# Altium project Sayma_RTM.PrjPcb (part 11 of 11)
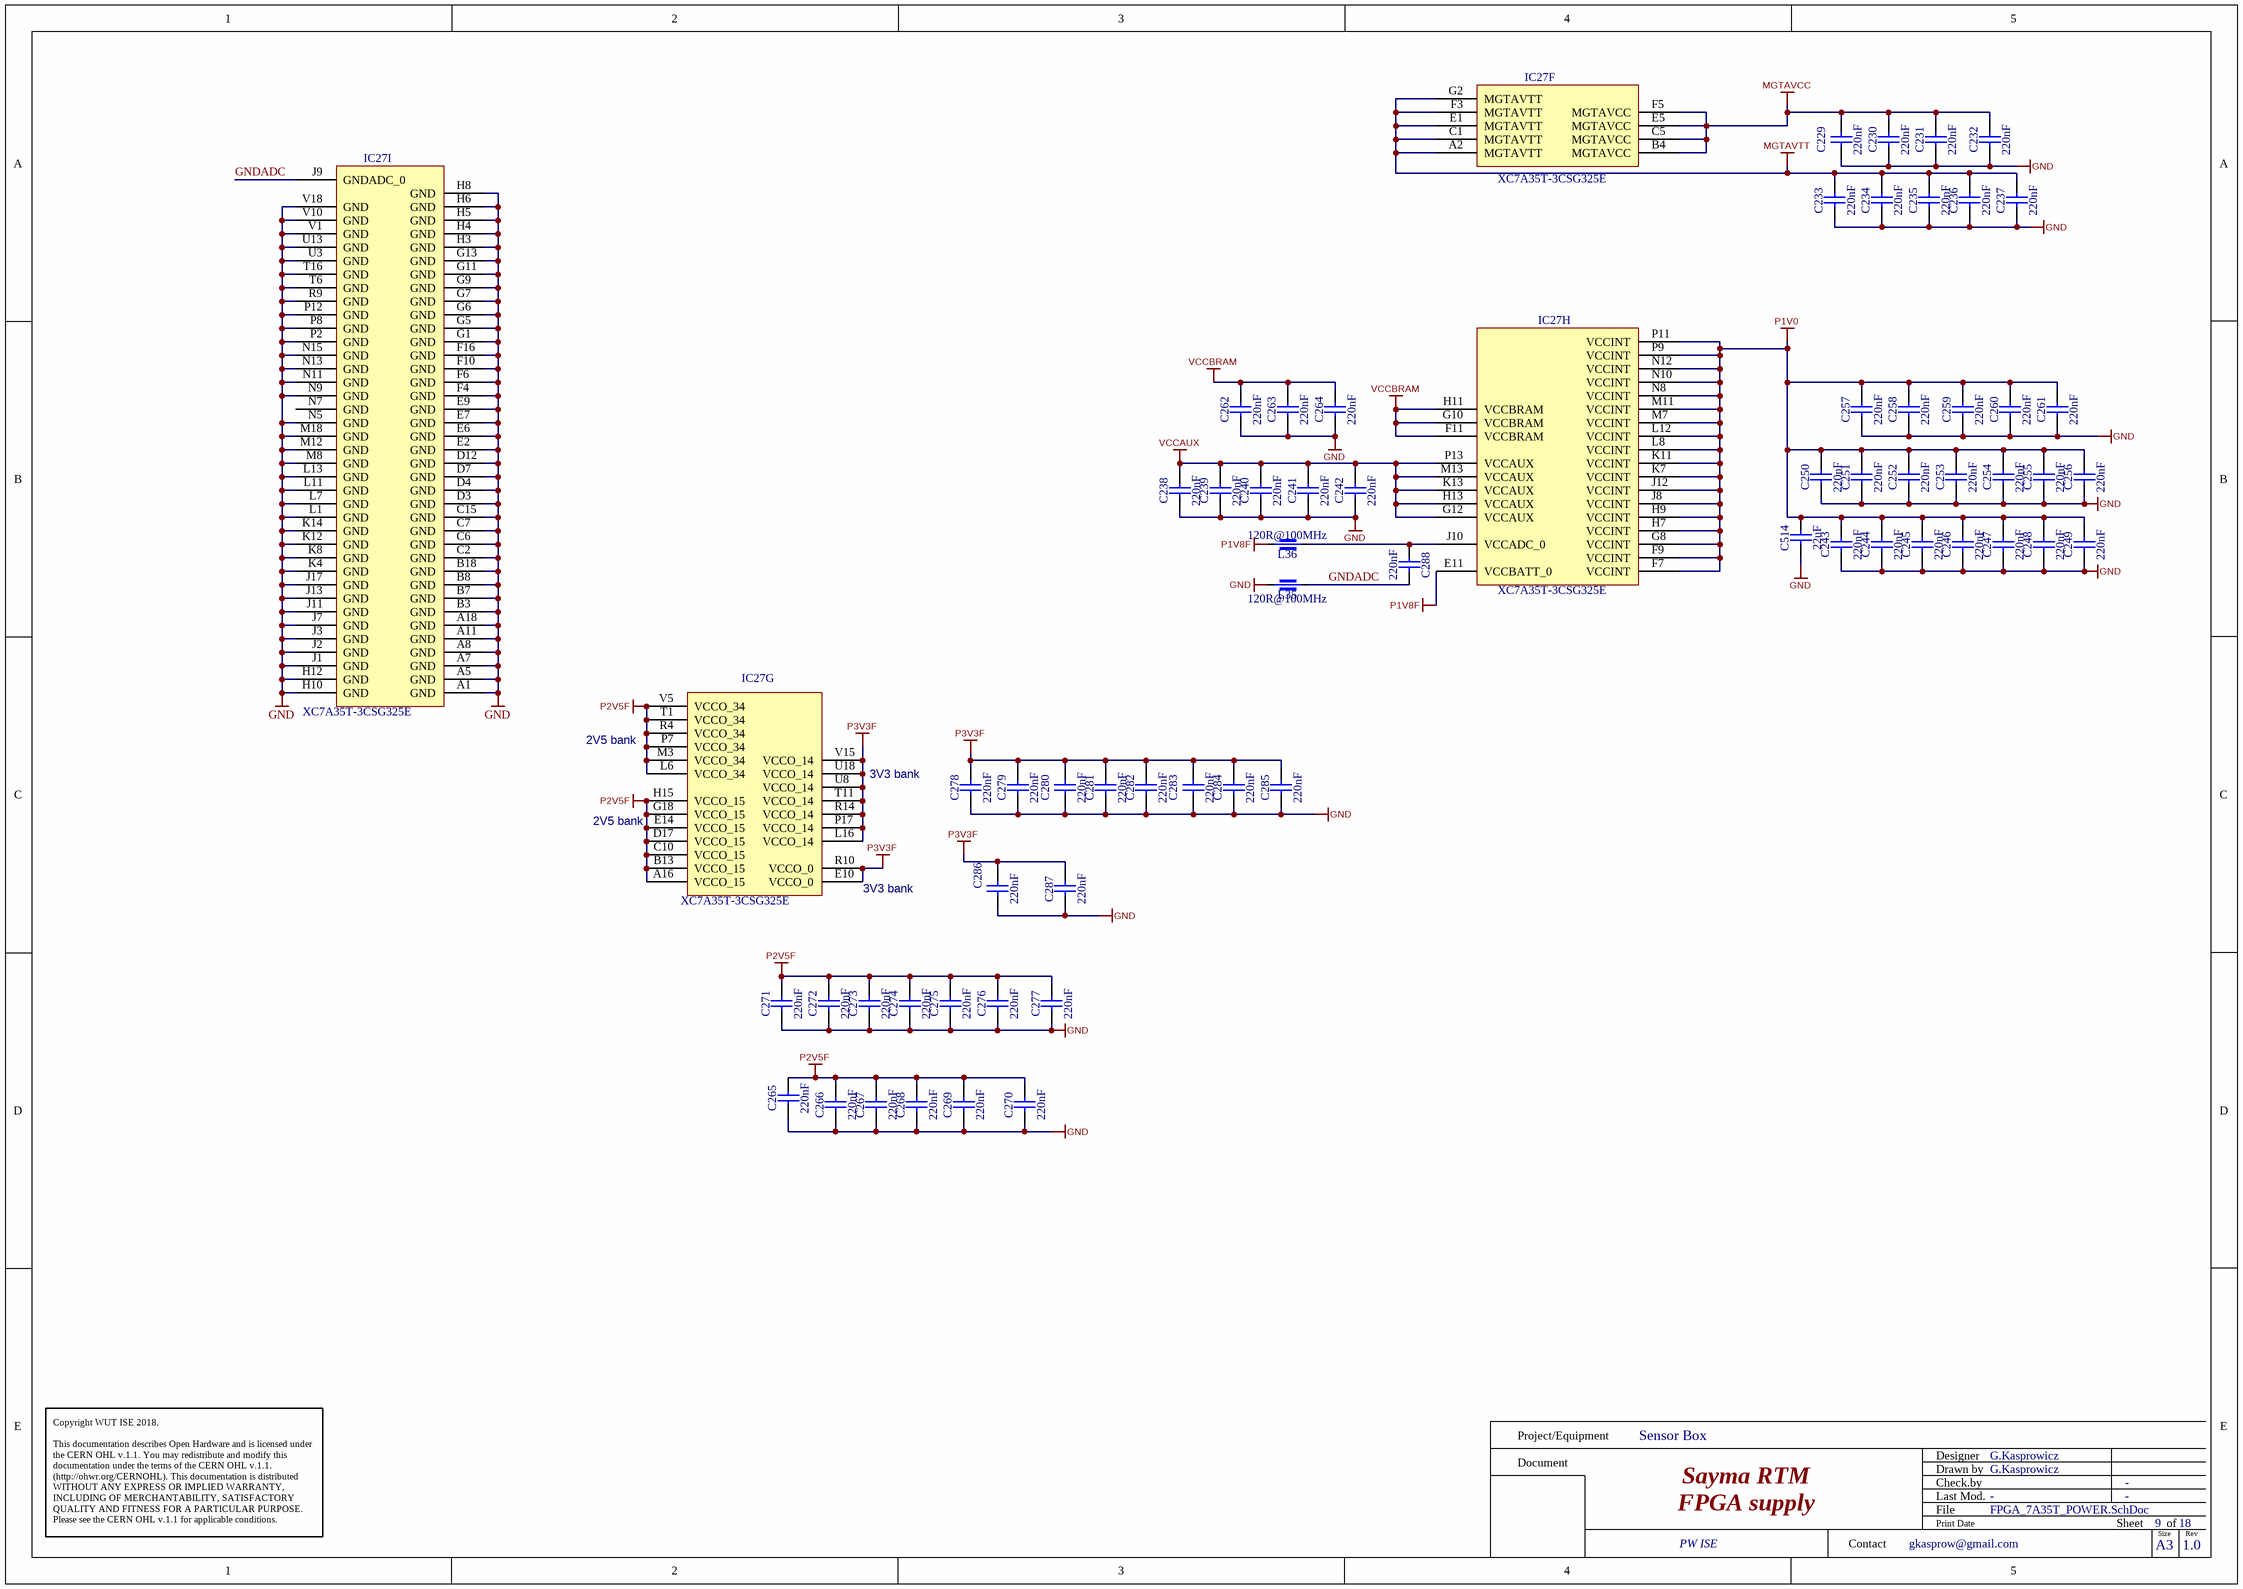
[diagram p117: FPGA_7A35T_POWER.SchDoc]

## Nets that join several sheets
GND: Sayma_RTM (9 pins), FPGA_7A35T (27 pins), DAC_JESD204B1 (158 pins), DAC_JESD204B0 (158 pins), PWR_SEPIC_N6V (60 pins), PWR_SEPIC_P12V_N12V (71 pins), PWR_Buck_2V_4V_4A (89 pins), PWR_Buck_6V_8A (25 pins), PWR_buck_FPGA_EXAR (74 pins), SI5324_CDR_WR_clocks (60 pins), HMC830_CLK_DIST (105 pins), RTM_IPMI (26 pins), DAC_AFE_Mezzanine0 (312 pins), I2C_Switch_temp_sens (16 pins), RTM_CON (62 pins), DAC_AFE_Mezzanine1 (312 pins), CLK_HMC7043 (73 pins), FPGA_7A35T_GTP (7 pins), FPGA_7A35T_POWER (135 pins)
MGTAVCC: PWR_buck_FPGA_EXAR (C548.2 L27.2), FPGA_7A35T_POWER (8 pins)
MGTAVTT: PWR_buck_FPGA_EXAR (C106.2 C551.2 L58.2 NT9.2), FPGA_7A35T_GTP (R35.1), FPGA_7A35T_POWER (10 pins)
N6V0A: PWR_SEPIC_N6V (5 pins), DAC_AFE_Mezzanine0 (L5A.2), DAC_AFE_Mezzanine1 (L5B.2)
N12V0A: PWR_SEPIC_P12V_N12V (5 pins), DAC_AFE_Mezzanine0 (L3A.2), DAC_AFE_Mezzanine1 (L3B.2)
P1V0: PWR_buck_FPGA_EXAR (5 pins), FPGA_7A35T_POWER (38 pins)
P1V8F: PWR_buck_FPGA_EXAR (10 pins), FPGA_7A35T_POWER (IC27.E11 L36.1)
P2V0: DAC_JESD204B1 (30 pins), DAC_JESD204B0 (30 pins), PWR_Buck_2V_4V_4A (C501.1 C580.2 L7.2), PWR_buck_FPGA_EXAR (NT3.1)
P2V5F: FPGA_7A35T (12 pins), DAC_JESD204B1 (L14A.1), DAC_JESD204B0 (L14B.1), PWR_buck_FPGA_EXAR (10 pins), DAC_AFE_Mezzanine0 (L6A.2), DAC_AFE_Mezzanine1 (L6B.2), FPGA_7A35T_GTP (L34.2), FPGA_7A35T_POWER (26 pins)
P3V3: PWR_buck_FPGA_EXAR (C506.1 C588.2 L11.2 NT2.2), DAC_AFE_Mezzanine0 (L4A.2), I2C_Switch_temp_sens (12 pins), DAC_AFE_Mezzanine1 (L4B.2)
P3V3_CLKDIS1: HMC830_CLK_DIST (L24.1), CLK_HMC7043 (7 pins)
P3V3F: FPGA_7A35T (14 pins), PWR_buck_FPGA_EXAR (C547.2 L11.1 L59.2 L60.2), FPGA_7A35T_POWER (19 pins)
P3V3MP: RTM_POWER_SUPPLY (R90.2), PWR_buck_FPGA_EXAR (5 pins), RTM_IPMI (34 pins), DAC_AFE_Mezzanine0 (L9A.2), I2C_Switch_temp_sens (24 pins), RTM_CON (J1.c2), DAC_AFE_Mezzanine1 (L9B.2)
P4V0: DAC_JESD204B1 (5 pins), DAC_JESD204B0 (5 pins), PWR_Buck_2V_4V_4A (C500.1 C579.2 L40.2 NT1.1), SI5324_CDR_WR_clocks (L17.1), CLK_HMC7043 (L89.1)
P6V0A: PWR_Buck_6V_8A (C502.1 C581.2 L8.2 NT5.1), HMC830_CLK_DIST (L13.1 R127.2), DAC_AFE_Mezzanine0 (L2A.1), DAC_AFE_Mezzanine1 (L2B.1)
P12V0: PWR_SEPIC_N6V (10 pins), PWR_SEPIC_P12V_N12V (10 pins), PWR_Buck_2V_4V_4A (40 pins), PWR_Buck_6V_8A (6 pins), PWR_buck_FPGA_EXAR (15 pins), RTM_CON (J1.a1 J1.a2 J1.b1 J1.b2)
P12V0A: PWR_SEPIC_P12V_N12V (5 pins), DAC_AFE_Mezzanine0 (L1A.1), DAC_AFE_Mezzanine1 (L1B.1)
VCCAUX: PWR_buck_FPGA_EXAR (C510.2 L19.2), FPGA_7A35T_POWER (10 pins)
VCCBRAM: PWR_buck_FPGA_EXAR (C103.2 L28.2), FPGA_7A35T_POWER (6 pins)
CDR_CLK_CLEAN2_N: FPGA_7A35T (IC27.R1 R245.2), SI5324_CDR_WR_clocks (C129.2)
CDR_CLK_CLEAN2_P: FPGA_7A35T (IC27.R2 R244.2), SI5324_CDR_WR_clocks (C128.2)
CDR_CLK_CLEAN3_N: SI5324_CDR_WR_clocks (C122.2), HMC830_CLK_DIST (IC46.2)
CDR_CLK_CLEAN3_P: SI5324_CDR_WR_clocks (C121.2), HMC830_CLK_DIST (IC46.1)
CDR_CLK_CTRL.CDR_CLK_CLEAN1_N: SI5324_CDR_WR_clocks (C359.2), FPGA_7A35T_GTP (IC27.B5)
CDR_CLK_CTRL.CDR_CLK_CLEAN1_P: SI5324_CDR_WR_clocks (C125.2), FPGA_7A35T_GTP (IC27.B6)
DAC0_IRQn: FPGA_7A35T (IC27.T4), DAC_JESD204B0 (IC5B.60)
DAC0_RESETn: FPGA_7A35T (IC27.T3), DAC_JESD204B0 (IC5B.61)
DAC0_SPI_CSn: FPGA_7A35T (IC27.U4), DAC_JESD204B0 (IC5B.65 TP66B.1)
DAC0_SPI_SCLK: FPGA_7A35T (IC27.V4), DAC_JESD204B0 (IC5B.64 TP65B.1)
DAC0_SPI_SDIO: FPGA_7A35T (IC27.P6), DAC_JESD204B0 (IC5B.63 TP64B.1)
DAC0_SPI_SDO: FPGA_7A35T (IC27.P5), DAC_JESD204B0 (IC5B.62 TP63B.1)
DAC0_TXEN0: FPGA_7A35T (IC27.U6), DAC_JESD204B0 (IC5B.11)
DAC0_TXEN1: FPGA_7A35T (IC27.U5), DAC_JESD204B0 (IC5B.12)
DAC1_IRQn: FPGA_7A35T (IC27.K5), DAC_JESD204B1 (IC5A.60)
DAC1_RESETn: FPGA_7A35T (IC27.J5), DAC_JESD204B1 (IC5A.61)
DAC1_SPI_CSn: FPGA_7A35T (IC27.J4), DAC_JESD204B1 (IC5A.65 TP66A.1)
DAC1_SPI_SCLK: FPGA_7A35T (IC27.K2), DAC_JESD204B1 (IC5A.64 TP65A.1)
DAC1_SPI_SDIO: FPGA_7A35T (IC27.K1), DAC_JESD204B1 (IC5A.63 TP64A.1)
DAC1_SPI_SDO: FPGA_7A35T (IC27.K3), DAC_JESD204B1 (IC5A.62 TP63A.1)
DAC1_TXEN0: FPGA_7A35T (IC27.L2), DAC_JESD204B1 (IC5A.11)
DAC1_TXEN1: FPGA_7A35T (IC27.L4), DAC_JESD204B1 (IC5A.12)
DAC_CLK_N: DAC_JESD204B1 (IC5A.3 R232A.1), CLK_HMC7043 (C354.2)
DAC_CLK_N: DAC_JESD204B0 (IC5B.3 R232B.1), CLK_HMC7043 (C358.2)
DAC_CLK_P: DAC_JESD204B1 (IC5A.2 R232A.2), CLK_HMC7043 (C353.2)
DAC_CLK_P: DAC_JESD204B0 (IC5B.2 R232B.2), CLK_HMC7043 (C357.2)
DAC_SYSREF_N: DAC_JESD204B1 (IC5A.6 R231A.1), CLK_HMC7043 (R56.2 R130.1)
DAC_SYSREF_N: DAC_JESD204B0 (IC5B.6 R231B.1), CLK_HMC7043 (R58.2 R132.1)
DAC_SYSREF_P: DAC_JESD204B1 (IC5A.5 R231A.2), CLK_HMC7043 (R39.2 R126.1)
DAC_SYSREF_P: DAC_JESD204B0 (IC5B.5 R231B.2), CLK_HMC7043 (R57.2 R131.1)
EN: PWR_SEPIC_N6V (IC50.B7 IC50.K7), PWR_SEPIC_P12V_N12V (IC49.B7 IC49.K7), PWR_Buck_2V_4V_4A (IC18.J5 IC18.J9), PWR_Buck_6V_8A (IC48.10), PWR_buck_FPGA_EXAR (IC33.C6 MOD1.12 R182.1), RTM_IPMI (D1.2 R121.1 T2.3)
EN_PWR_HMC830: FPGA_7A35T (IC6.9), HMC830_CLK_DIST (5 pins)
EXAR_I2C.SCL: PWR_buck_FPGA_EXAR (MOD1.11 W1.2), I2C_Switch_temp_sens (IC1.17 IC2.17 R1.1 TP25.1)
EXAR_I2C.SDA: PWR_buck_FPGA_EXAR (MOD1.10 W1.3), I2C_Switch_temp_sens (IC1.16 IC2.16 R2.1 TP24.1)
FPGA_DXN: FPGA_7A35T (IC27.M9), RTM_IPMI (C107.1 C156.1 R99.1)
FPGA_DXP: FPGA_7A35T (IC27.M10), RTM_IPMI (C107.2 C156.2 IC35.3)
GT16RX_N: RTM_CON (J1.b10), FPGA_7A35T_GTP (C159.1)
GT16RX_P: RTM_CON (J1.a10), FPGA_7A35T_GTP (C160.1)
GT16TX_N: RTM_CON (J1.b8), FPGA_7A35T_GTP (IC27.E3)
GT16TX_P: RTM_CON (J1.a8), FPGA_7A35T_GTP (IC27.E4)
GT_CLK0_IN_N: RTM_CON (J2.b1), CLK_HMC7043 (R93.2)
GT_CLK0_IN_P: RTM_CON (J2.a1), CLK_HMC7043 (R33.2)
Helper_DCXO_N: FPGA_7A35T (IC27.N2 R125.2), SI5324_CDR_WR_clocks (R297.2)
Helper_DCXO_OE: FPGA_7A35T (IC14.9), SI5324_CDR_WR_clocks (R383.2 R385.2)
Helper_DCXO_P: FPGA_7A35T (IC27.N3 R60.2), SI5324_CDR_WR_clocks (R296.2)
Helper_DCXO_SCL: FPGA_7A35T (IC27.T15), SI5324_CDR_WR_clocks (OSC5.8 R365.1 TP32.1)
Helper_DCXO_SDA: FPGA_7A35T (IC27.R16), SI5324_CDR_WR_clocks (OSC5.7 R364.1 TP31.1)
HMC830_SPI_SEN: FPGA_7A35T (IC27.K16), HMC830_CLK_DIST (IC40.30 R107.2 TP5.1)
HMC7043_RESET: FPGA_7A35T (IC27.J18 R52.2), CLK_HMC7043 (IC58.5)
HMC7043_SLEN: FPGA_7A35T (IC27.R17), CLK_HMC7043 (IC58.31 TP58.1)
HMC_7043_OUT_EN: FPGA_7A35T (IC6.8), CLK_HMC7043 (R94.2 T11.1 TP62.1)
HMC_SPI_GPIO: FPGA_7A35T (IC27.L14), CLK_HMC7043 (IC58.34 TP61.1)
HMC_SPI_SCLK: FPGA_7A35T (IC27.T18), HMC830_CLK_DIST (IC40.32 R108.2 TP2.1), CLK_HMC7043 (IC58.32 TP59.1)
HMC_SPI_SDATA: FPGA_7A35T (IC27.R18), HMC830_CLK_DIST (IC40.31 TP3.1), CLK_HMC7043 (IC58.33 TP60.1)
HMC_SPI_SDO: FPGA_7A35T (IC27.J15), HMC830_CLK_DIST (IC40.33 TP4.1)
I2C_SCL0: DAC_AFE_Mezzanine0 (J11A.k35), I2C_Switch_temp_sens (IC1.2 IC2.2 R15.1 TP10.1)
I2C_SCL0: I2C_Switch_temp_sens (IC1.6 IC2.6 R11.1 TP15.1), DAC_AFE_Mezzanine1 (J11B.k35)
I2C_SCL1: DAC_AFE_Mezzanine0 (J11A.j35), I2C_Switch_temp_sens (IC1.4 IC2.4 R13.1 TP13.1)
I2C_SCL1: I2C_Switch_temp_sens (IC1.8 IC2.8 R9.1 TP17.1), DAC_AFE_Mezzanine1 (J11B.j35)
I2C_SDA0: DAC_AFE_Mezzanine0 (J11A.k34), I2C_Switch_temp_sens (IC1.1 IC2.1 R16.1 TP8.1)
I2C_SDA0: I2C_Switch_temp_sens (IC1.5 IC2.5 R12.1 TP14.1), DAC_AFE_Mezzanine1 (J11B.k34)
I2C_SDA1: DAC_AFE_Mezzanine0 (J11A.j34), I2C_Switch_temp_sens (IC1.3 IC2.3 R14.1 TP12.1)
I2C_SDA1: I2C_Switch_temp_sens (IC1.7 IC2.7 R10.1 TP16.1), DAC_AFE_Mezzanine1 (J11B.j34)
I2C_SW_FPGA_RESETn: FPGA_7A35T (IC27.R15), I2C_Switch_temp_sens (IC2.24 R27.1)
IPMI_I2C.SCL: RTM_IPMI (7 pins), I2C_Switch_temp_sens (IC1.19 R20.2 TP7.1)
IPMI_I2C.SDA: RTM_IPMI (7 pins), I2C_Switch_temp_sens (IC1.20 R21.2 TP6.1)
JTAG.TCK: FPGA_7A35T (IC27.F8), RTM_CON (J1.e1)
JTAG.TDI: FPGA_7A35T (IC27.T9), RTM_CON (J1.e2)
JTAG.TDO: FPGA_7A35T (IC27.T8), RTM_CON (J1.f1)
JTAG.TMS: FPGA_7A35T (IC27.R8), RTM_CON (J1.f2)
Main_DCXO_OE: FPGA_7A35T (IC14.10), SI5324_CDR_WR_clocks (R382.2 R384.2)
Main_DCXO_SCL: FPGA_7A35T (IC27.P14), SI5324_CDR_WR_clocks (OSC4.8 R362.1 TP28.1)
Main_DCXO_SDA: FPGA_7A35T (IC27.U15), SI5324_CDR_WR_clocks (OSC4.7 R361.1 TP27.1)
MEZZ0_IO0: FPGA_7A35T (IC27.U16), DAC_AFE_Mezzanine0 (J11A.f37)
MEZZ0_IO1: FPGA_7A35T (IC27.V16), DAC_AFE_Mezzanine0 (J11A.g37)
MEZZ0_IO2: FPGA_7A35T (IC27.V17), DAC_AFE_Mezzanine0 (J11A.h37)
MEZZ0_IO3: FPGA_7A35T (IC27.R13), DAC_AFE_Mezzanine0 (J11A.j39)
MEZZ0_IO4: FPGA_7A35T (IC27.T13), DAC_AFE_Mezzanine0 (J11A.j38)
MEZZ0_IO5: FPGA_7A35T (IC27.U14), DAC_AFE_Mezzanine0 (J11A.j37)
MEZZ0_IO6: FPGA_7A35T (IC27.V14), DAC_AFE_Mezzanine0 (J11A.k39)
MEZZ0_IO7: FPGA_7A35T (IC27.V12), DAC_AFE_Mezzanine0 (J11A.k38)
MEZZ0_IO8: FPGA_7A35T (IC27.V13), DAC_AFE_Mezzanine0 (J11A.k37)
MEZZ0_IO9: FPGA_7A35T (IC27.T12), DAC_AFE_Mezzanine0 (J11A.e37)
MEZZ0_IO10: FPGA_7A35T (IC27.U12), DAC_AFE_Mezzanine0 (J11A.d37)
MEZZ0_IO11: FPGA_7A35T (IC27.U11), DAC_AFE_Mezzanine0 (J11A.c37)
MEZZ0_IO12: FPGA_7A35T (IC27.V11), DAC_AFE_Mezzanine0 (J11A.b37)
MEZZ0_IO13: FPGA_7A35T (IC27.U9), DAC_AFE_Mezzanine0 (J11A.b36)
MEZZ0_IO14: FPGA_7A35T (IC27.V9), DAC_AFE_Mezzanine0 (J11A.a37)
MEZZ0_IO15: FPGA_7A35T (IC27.U10), DAC_AFE_Mezzanine0 (J11A.a36)
MEZZ0_LVDS0_N: FPGA_7A35T (IC27.E18), DAC_AFE_Mezzanine0 (J11A.a39)
MEZZ0_LVDS0_P: FPGA_7A35T (IC27.F17), DAC_AFE_Mezzanine0 (J11A.a38)
MEZZ0_LVDS1_N: FPGA_7A35T (IC27.F18), DAC_AFE_Mezzanine0 (J11A.b39)
MEZZ0_LVDS1_P: FPGA_7A35T (IC27.G17), DAC_AFE_Mezzanine0 (J11A.b38)
MEZZ0_LVDS2_N: FPGA_7A35T (IC27.H18), DAC_AFE_Mezzanine0 (J11A.c39)
MEZZ0_LVDS2_P: FPGA_7A35T (IC27.H17), DAC_AFE_Mezzanine0 (J11A.c38)
MEZZ0_LVDS3_N: FPGA_7A35T (IC27.F15), DAC_AFE_Mezzanine0 (J11A.d39)
MEZZ0_LVDS3_P: FPGA_7A35T (IC27.G15), DAC_AFE_Mezzanine0 (J11A.d38)
MEZZ0_LVDS4_N: FPGA_7A35T (IC27.F14), DAC_AFE_Mezzanine0 (J11A.e39)
MEZZ0_LVDS4_P: FPGA_7A35T (IC27.G14), DAC_AFE_Mezzanine0 (J11A.e38)
MEZZ0_LVDS5_N: FPGA_7A35T (IC27.D18), DAC_AFE_Mezzanine0 (J11A.f39)
MEZZ0_LVDS5_P: FPGA_7A35T (IC27.E17), DAC_AFE_Mezzanine0 (J11A.f38)
MEZZ0_LVDS6_N: FPGA_7A35T (IC27.C18), DAC_AFE_Mezzanine0 (J11A.g39)
MEZZ0_LVDS6_P: FPGA_7A35T (IC27.C17), DAC_AFE_Mezzanine0 (J11A.g38)
MEZZ0_LVDS7_N: FPGA_7A35T (IC27.G16), DAC_AFE_Mezzanine0 (J11A.h39)
MEZZ0_LVDS7_P: FPGA_7A35T (IC27.H16), DAC_AFE_Mezzanine0 (J11A.h38)
MEZZ1_IO0: FPGA_7A35T (IC27.J16), DAC_AFE_Mezzanine1 (J11B.f37)
MEZZ1_IO1: FPGA_7A35T (IC27.K18), DAC_AFE_Mezzanine1 (J11B.g37)
MEZZ1_IO2: FPGA_7A35T (IC27.K17), DAC_AFE_Mezzanine1 (J11B.h37)
MEZZ1_IO3: FPGA_7A35T (IC27.L18), DAC_AFE_Mezzanine1 (J11B.j39)
MEZZ1_IO4: FPGA_7A35T (IC27.J14), DAC_AFE_Mezzanine1 (J11B.j38)
MEZZ1_IO5: FPGA_7A35T (IC27.K15), DAC_AFE_Mezzanine1 (J11B.j37)
MEZZ1_IO6: FPGA_7A35T (IC27.L15), DAC_AFE_Mezzanine1 (J11B.k39)
MEZZ1_IO7: FPGA_7A35T (IC27.M15), DAC_AFE_Mezzanine1 (J11B.k38)
MEZZ1_IO8: FPGA_7A35T (IC27.M16), DAC_AFE_Mezzanine1 (J11B.k37)
MEZZ1_IO9: FPGA_7A35T (IC27.M17), DAC_AFE_Mezzanine1 (J11B.e37)
MEZZ1_IO10: FPGA_7A35T (IC27.M14), DAC_AFE_Mezzanine1 (J11B.d37)
MEZZ1_IO11: FPGA_7A35T (IC27.N14), DAC_AFE_Mezzanine1 (J11B.c37)
MEZZ1_IO12: FPGA_7A35T (IC27.N16), DAC_AFE_Mezzanine1 (J11B.b37)
MEZZ1_IO13: FPGA_7A35T (IC27.N17), DAC_AFE_Mezzanine1 (J11B.b36)
MEZZ1_IO14: FPGA_7A35T (IC27.N18), DAC_AFE_Mezzanine1 (J11B.a37)
MEZZ1_IO15: FPGA_7A35T (IC27.P18), DAC_AFE_Mezzanine1 (J11B.a36)
MEZZ1_LVDS0_N: FPGA_7A35T (IC27.A14), DAC_AFE_Mezzanine1 (J11B.a39)
MEZZ1_LVDS0_P: FPGA_7A35T (IC27.A13), DAC_AFE_Mezzanine1 (J11B.a38)
MEZZ1_LVDS1_N: FPGA_7A35T (IC27.A12), DAC_AFE_Mezzanine1 (J11B.b39)
MEZZ1_LVDS1_P: FPGA_7A35T (IC27.B12), DAC_AFE_Mezzanine1 (J11B.b38)
MEZZ1_LVDS2_N: FPGA_7A35T (IC27.C12), DAC_AFE_Mezzanine1 (J11B.c39)
MEZZ1_LVDS2_P: FPGA_7A35T (IC27.D11), DAC_AFE_Mezzanine1 (J11B.c38)
MEZZ1_LVDS3_N: FPGA_7A35T (IC27.A10), DAC_AFE_Mezzanine1 (J11B.d39)
MEZZ1_LVDS3_P: FPGA_7A35T (IC27.B10), DAC_AFE_Mezzanine1 (J11B.d38)
MEZZ1_LVDS4_N: FPGA_7A35T (IC27.B11), DAC_AFE_Mezzanine1 (J11B.e39)
MEZZ1_LVDS4_P: FPGA_7A35T (IC27.C11), DAC_AFE_Mezzanine1 (J11B.e38)
MEZZ1_LVDS5_N: FPGA_7A35T (IC27.A9), DAC_AFE_Mezzanine1 (J11B.f39)
MEZZ1_LVDS5_P: FPGA_7A35T (IC27.B9), DAC_AFE_Mezzanine1 (J11B.f38)
MEZZ1_LVDS6_N: FPGA_7A35T (IC27.C9), DAC_AFE_Mezzanine1 (J11B.g39)
MEZZ1_LVDS6_P: FPGA_7A35T (IC27.D9), DAC_AFE_Mezzanine1 (J11B.g38)
MEZZ1_LVDS7_N: FPGA_7A35T (IC27.C8), DAC_AFE_Mezzanine1 (J11B.h39)
MEZZ1_LVDS7_P: FPGA_7A35T (IC27.D8), DAC_AFE_Mezzanine1 (J11B.h38)
OUT0_N: DAC_JESD204B1 (IC5A.83 R223A.1), DAC_AFE_Mezzanine1 (J11B.g23)
OUT0_N: DAC_JESD204B0 (IC5B.83 R223B.1), DAC_AFE_Mezzanine0 (J11A.g23)
OUT0_P: DAC_JESD204B1 (IC5A.84 R224A.1), DAC_AFE_Mezzanine1 (J11B.g24)
OUT0_P: DAC_JESD204B0 (IC5B.84 R224B.1), DAC_AFE_Mezzanine0 (J11A.g24)
OUT1_N: DAC_JESD204B1 (IC5A.79 R225A.1), DAC_AFE_Mezzanine1 (J11B.h17)
OUT1_N: DAC_JESD204B0 (IC5B.79 R225B.1), DAC_AFE_Mezzanine0 (J11A.h17)
OUT1_P: DAC_JESD204B1 (IC5A.78 R226A.1), DAC_AFE_Mezzanine1 (J11B.h18)
OUT1_P: DAC_JESD204B0 (IC5B.78 R226B.1), DAC_AFE_Mezzanine0 (J11A.h18)
OUT2_N: DAC_JESD204B1 (IC5A.73 R227A.1), DAC_AFE_Mezzanine1 (J11B.g11)
OUT2_N: DAC_JESD204B0 (IC5B.73 R227B.1), DAC_AFE_Mezzanine0 (J11A.g11)
OUT2_P: DAC_JESD204B1 (IC5A.74 R228A.1), DAC_AFE_Mezzanine1 (J11B.g12)
OUT2_P: DAC_JESD204B0 (IC5B.74 R228B.1), DAC_AFE_Mezzanine0 (J11A.g12)
OUT3_N: DAC_JESD204B1 (IC5A.69 R229A.1), DAC_AFE_Mezzanine1 (J11B.h5)
OUT3_N: DAC_JESD204B0 (IC5B.69 R229B.1), DAC_AFE_Mezzanine0 (J11A.h5)
OUT3_P: DAC_JESD204B1 (IC5A.68 R230A.1), DAC_AFE_Mezzanine1 (J11B.h6)
OUT3_P: DAC_JESD204B0 (IC5B.68 R230B.1), DAC_AFE_Mezzanine0 (J11A.h6)
PGOOD: RTM_POWER_SUPPLY (R90.1), PWR_SEPIC_N6V (IC50.D6 IC50.H6), PWR_SEPIC_P12V_N12V (IC49.D6 IC49.H6), PWR_Buck_2V_4V_4A (IC18.H5), PWR_Buck_6V_8A (IC48.7), PWR_buck_FPGA_EXAR (MOD1.8), RTM_IPMI (T3.1)
REC_CLOCK_C_N: FPGA_7A35T (IC27.M1), SI5324_CDR_WR_clocks (C173.2 R54.1)
REC_CLOCK_C_P: FPGA_7A35T (IC27.M2), SI5324_CDR_WR_clocks (C172.2 R54.2)
REF0_LO_N: HMC830_CLK_DIST (C224.2), DAC_AFE_Mezzanine0 (J11A.c25)
REF0_LO_P: HMC830_CLK_DIST (C227.2), DAC_AFE_Mezzanine0 (J11A.c26)
REF1_LO_N: HMC830_CLK_DIST (C225.2), DAC_AFE_Mezzanine1 (J11B.c25)
REF1_LO_P: HMC830_CLK_DIST (C226.2), DAC_AFE_Mezzanine1 (J11B.c26)
REF2_N: FPGA_7A35T (IC27.D15 R144.1), HMC830_CLK_DIST (C169.2)
REF2_P: FPGA_7A35T (IC27.E15 R146.1), HMC830_CLK_DIST (C168.2)
REF_CLK_SRC_EXT_SEL: FPGA_7A35T (IC6.10), HMC830_CLK_DIST (IC46.32 TP1.1)
RESETn: FPGA_7A35T (R46.1), RTM_IPMI (IC36.10 R120.1)
RF_OUT_N: HMC830_CLK_DIST (C12.1 C14.1), CLK_HMC7043 (C437.1)
RF_OUT_P: HMC830_CLK_DIST (C11.1 C13.1), CLK_HMC7043 (C436.1)
RTM_FPGA_GTP_Rx1_N: DAC_AFE_Mezzanine0 (J11A.b31), FPGA_7A35T_GTP (IC27.A3)
RTM_FPGA_GTP_Rx1_P: DAC_AFE_Mezzanine0 (J11A.b30), FPGA_7A35T_GTP (IC27.A4)
RTM_FPGA_GTP_Rx3_N: DAC_AFE_Mezzanine1 (J11B.e32), FPGA_7A35T_GTP (IC27.G3)
RTM_FPGA_GTP_Rx3_P: DAC_AFE_Mezzanine1 (J11B.e31), FPGA_7A35T_GTP (IC27.G4)
RTM_FPGA_GTP_Tx1_N: DAC_AFE_Mezzanine0 (J11A.e32), FPGA_7A35T_GTP (C161.1)
RTM_FPGA_GTP_Tx1_P: DAC_AFE_Mezzanine0 (J11A.e31), FPGA_7A35T_GTP (C162.1)
RTM_FPGA_GTP_Tx3_N: DAC_AFE_Mezzanine1 (J11B.b31), FPGA_7A35T_GTP (C165.1)
RTM_FPGA_GTP_Tx3_P: DAC_AFE_Mezzanine1 (J11B.b30), FPGA_7A35T_GTP (C166.1)
RTM_FPGA_SCL: FPGA_7A35T (IC27.P15), I2C_Switch_temp_sens (IC2.19 R22.1 TP11.1)
RTM_FPGA_SDA: FPGA_7A35T (IC27.P16), I2C_Switch_temp_sens (IC2.20 R23.1 TP9.1)
RTM_FPGA_SYSREF0_N: FPGA_7A35T (IC27.T2), CLK_HMC7043 (IC58.23)
RTM_FPGA_SYSREF0_P: FPGA_7A35T (IC27.R3), CLK_HMC7043 (IC58.22)
RTM_FPGA_SYSREF1_N: FPGA_7A35T (IC27.T5), CLK_HMC7043 (IC58.45)
RTM_FPGA_SYSREF1_P: FPGA_7A35T (IC27.R5), CLK_HMC7043 (IC58.44)
RTM_UART.Rx: FPGA_7A35T (IC27.U17), RTM_CON (J2.b7)
RTM_UART.Tx: FPGA_7A35T (IC27.T17), RTM_CON (J2.a7)
Si5324_I2C.SCL: SI5324_CDR_WR_clocks (IC31.22), I2C_Switch_temp_sens (IC1.13 IC2.13 R5.1 TP21.1)
Si5324_I2C.SDA: SI5324_CDR_WR_clocks (IC31.23), I2C_Switch_temp_sens (IC1.12 IC2.12 R6.1 TP20.1)
SI5324_INT_ALM: FPGA_7A35T (R31.1), SI5324_CDR_WR_clocks (IC31.3)
SI5324_RST: FPGA_7A35T (IC14.7), SI5324_CDR_WR_clocks (IC31.1)
WR_CLK_SEL: FPGA_7A35T (IC14.8), SI5324_CDR_WR_clocks (IC44.32)

## Assembly variants
Default: not fitted C11 C12 C127 C140 C141 C143 C144 C145 C146 C147 C511 C512 C513 IC16 L56 MOD1 MSBOXC1 MSBOXC2 MSBOXC3 OSC1 R50 R63 R64 R67 R68 R96 R98 R100 R106 R106 R113 R126 R130 R131 R132 R135 R136 R138 R140 R142 R142 R148 R148 R359 R360 R375 R379 R382 R383 R386 SH1 SH2 SH3